# Altium schematic sheet Micro-Controller Unit (MCU).SchDoc
size B; SheetNumber: 5; SheetTotal: 5
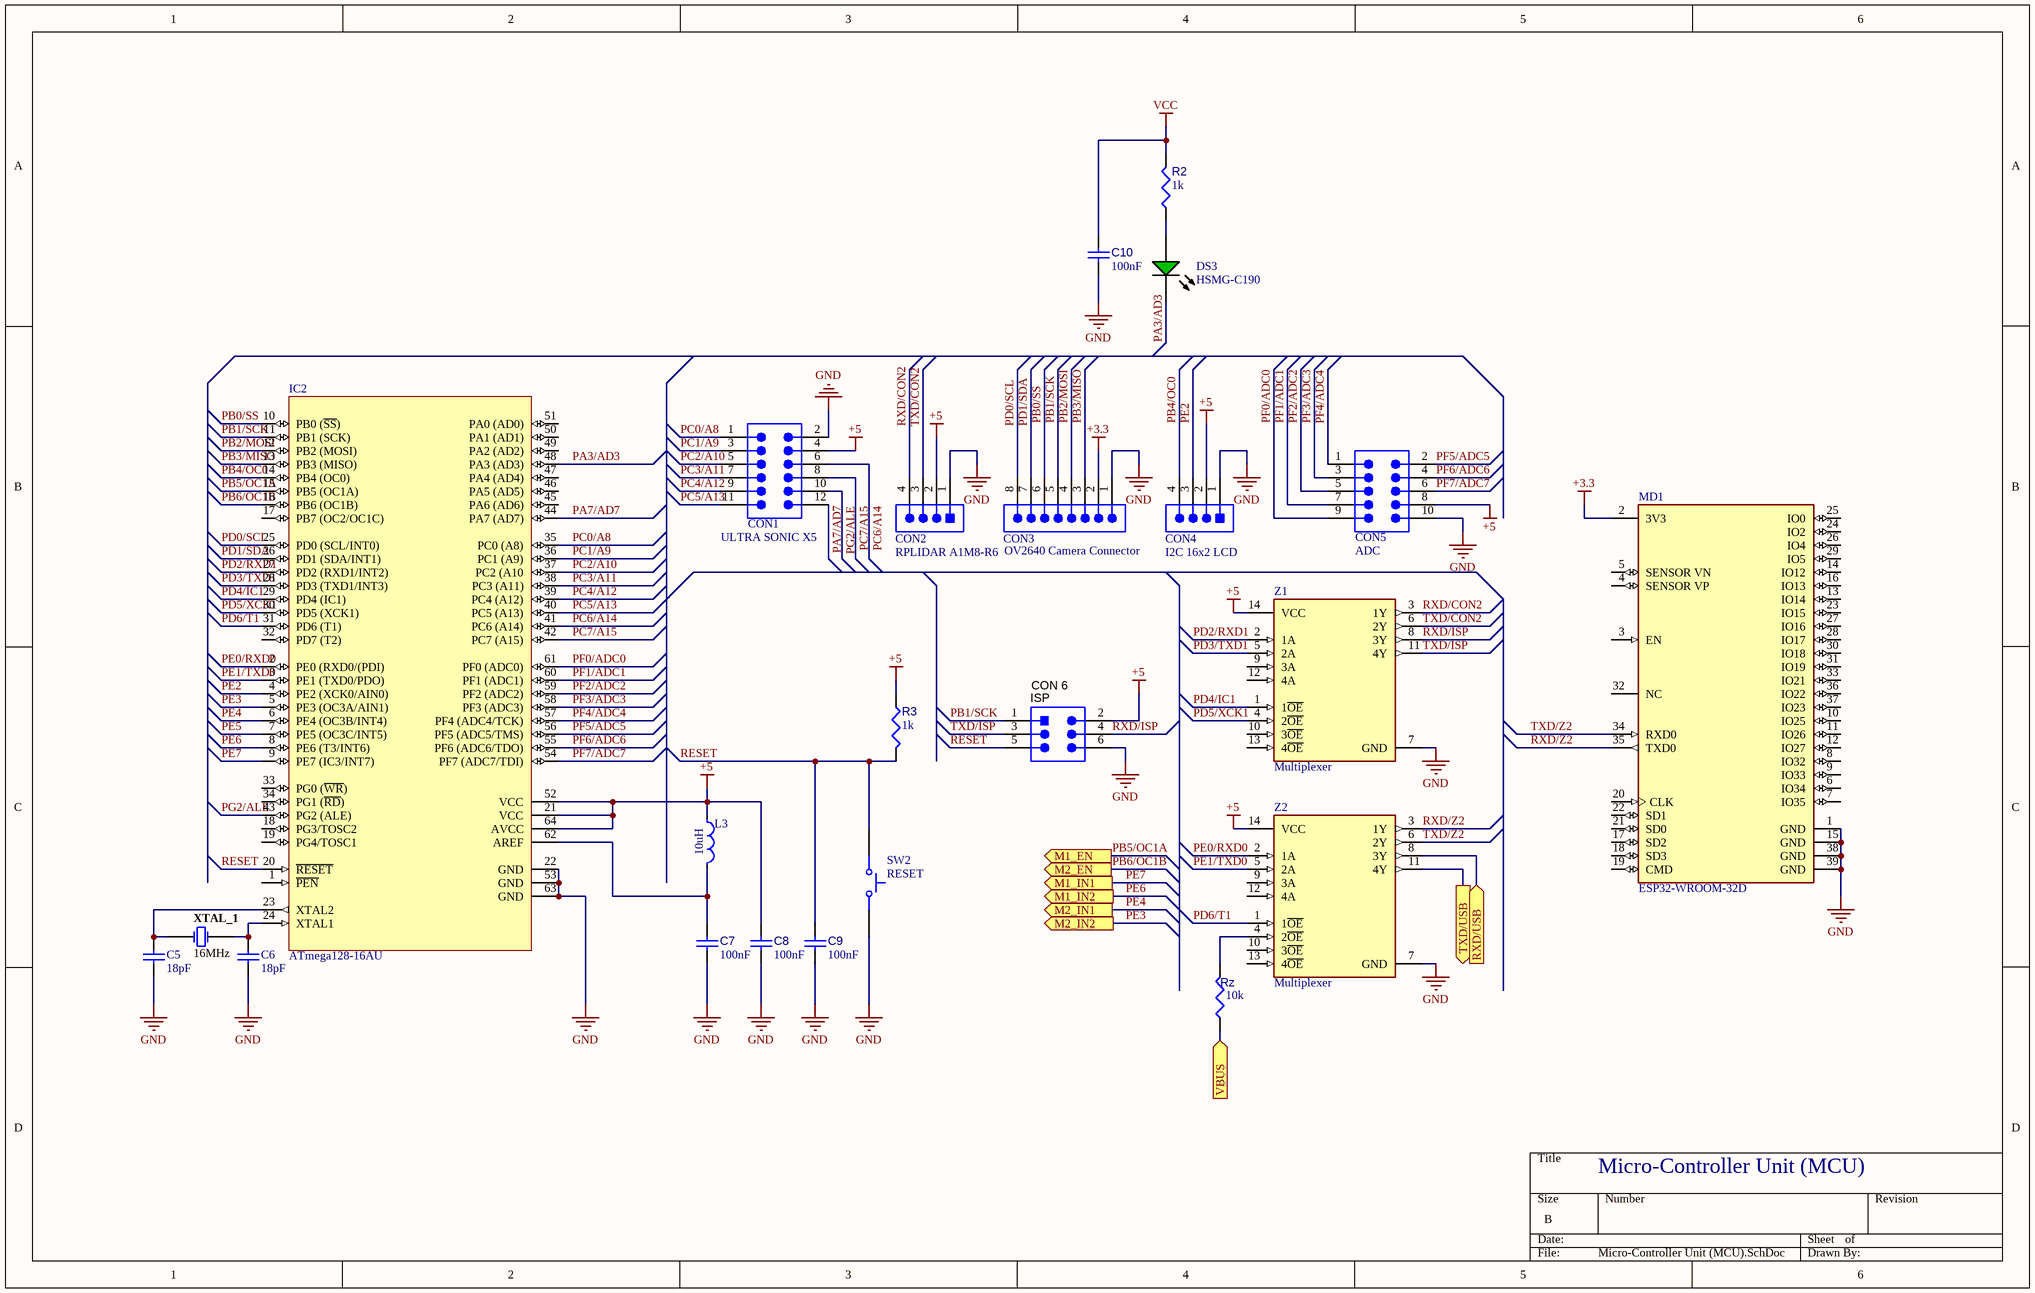
[diagram p0: Micro-Controller Unit (MCU).SchDoc]

## Parts
C5  18pF  [CAPC1608X90X40LL10T20]
C6  18pF  [CAPC1608X90X40LL10T20]
C7  value 100nF  [CAPC0402(1005)60_L]  (hidden comment: Capacitor 100nF +/-20% 50V 0402)
C8  value 100nF  [CAPC0402(1005)60_L]  (hidden comment: Capacitor 100nF +/-20% 50V 0402)
C9  value 100nF  [CAPC0402(1005)60_L]  (hidden comment: Capacitor 100nF +/-20% 50V 0402)
C10  value 100nF  [CAPC0402(1005)60_L]  (hidden comment: Capacitor 100nF +/-20% 50V 0402)
CON1  ULTRA SONIC X5  [61301221121]
CON2  RPLIDAR A1M8-R6  [MOLX-22-27-2041_V]
CON3  OV2640 Camera Connector  [61300811121]
CON4  I2C 16x2 LCD  [MOLX-22-27-2041_V]
CON5  ADC  [SMTC-TSM-105-01-X-DV]
DS3  HSMG-C190  [AVAG-HSMX-C190_V]
IC2  ATmega128-16AU  [64A_M]
ISP  CON 6  [AMPM-95278-101A06LF_V]
L3  10uH  [FP-IHLP-2525EZ-FP_2_413x3-MFG]
MD1  ESP32-WROOM-32D  [FP-ESP32-WROOM-32D-MFG]
R2  value 1k  [RESC1608X55X25ML10T15]  (hidden comment: Resistor 1k +/-1% 0603 100 mW)
R3  value 1k  [RESC1608X55X25ML10T15]  (hidden comment: Resistor 1k +/-1% 0603 100 mW)
Rz  value 10k  [RESC0402(1005)_L]  (hidden comment: 10KR2F)
SW2  RESET  [OMRON-B3U-1000_V]
XTAL_1  16MHz  [JPY-HC-49US]
Z1  Multiplexer  [FP-PW0014A-IPC_B]
Z2  Multiplexer  [FP-PW0014A-IPC_B]

## Ports
M1_EN (out), M1_IN1 (out), M1_IN2 (out), M2_EN (out), M2_IN1 (out), M2_IN2 (out), RXD/USB (in), TXD/USB (out), VBUS (in)

## Nets
+3.3: CON3.2 MD1.2(3V3)
+5: C8.1 CON1.4 CON2.2 CON4.2 CON5.8 IC2.21(VCC) IC2.52(VCC) IC2.64(AVCC) ISP.2 L3.1 R3.1 Z1.14(VCC) Z2.14(VCC)
GND: C5.1 C6.1 C7.2 C8.2 C9.2 C10.2 CON1.2 CON2.1 CON3.1 CON4.1 CON5.10 IC2.22(GND) IC2.53(GND) IC2.63(GND) ISP.6 MD1.1(GND) MD1.15(GND) MD1.38(GND) MD1.39(GND) SW2.2 Z1.7(GND) Z2.7(GND)
VCC: C10.1 R2.2
PA3/AD3: DS3.2(K) IC2.48(PA3_(AD3))
PA7/AD7: CON1.12 IC2.44(PA7_(AD7))
PB0/SS: CON3.6 IC2.10(PB0_(~{SS}))
PB1/SCK: CON3.5 IC2.11(PB1_(SCK)) ISP.1
PB2/MOSI: CON3.4 IC2.12(PB2_(MOSI))
PB3/MISO: CON3.3 IC2.13(PB3_(MISO))
PB4/OC0: CON4.4 IC2.14(PB4_(OC0))
PB5/OC1A: IC2.15(PB5_(OC1A)) ; port M1_EN
PB6/OC1B: IC2.16(PB6_(OC1B)) ; port M2_EN
PC0/A8: CON1.1 IC2.35(PC0_(A8))
PC1/A9: CON1.3 IC2.36(PC1_(A9))
PC2/A10: CON1.5 IC2.37(PC2_(A10)
PC3/A11: CON1.7 IC2.38(PC3_(A11))
PC4/A12: CON1.9 IC2.39(PC4_(A12))
PC5/A13: CON1.11 IC2.40(PC5_(A13))
PC6/A14: CON1.6 IC2.41(PC6_(A14))
PC7/A15: CON1.8 IC2.42(PC7_(A15))
PD0/SCL: CON3.8 IC2.25(PD0_(SCL/INT0))
PD1/SDA: CON3.7 IC2.26(PD1_(SDA/INT1))
PD2/RXD1: IC2.27(PD2_(RXD1/INT2)) Z1.2(1A)
PD3/TXD1: IC2.28(PD3_(TXD1/INT3)) Z1.5(2A)
PD4/IC1: IC2.29(PD4_(IC1)) Z1.1(1~{OE})
PD5/XCK1: IC2.30(PD5_(XCK1)) Z1.4(2~{OE})
PD6/T1: IC2.31(PD6_(T1)) Z2.1(1~{OE})
PE0/RXD0: IC2.2(PE0_(RXD0/(PDI)) Z2.2(1A)
PE1/TXD0: IC2.3(PE1_(TXD0/PDO)) Z2.5(2A)
PE2: CON4.3 IC2.4(PE2_(XCK0/AIN0))
PE3: IC2.5(PE3_(OC3A/AIN1)) ; port M2_IN2
PE4: IC2.6(PE4_(OC3B/INT4)) ; port M2_IN1
PE5: IC2.7(PE5_(OC3C/INT5))
PE6: IC2.8(PE6_(T3/INT6)) ; port M1_IN2
PE7: IC2.9(PE7_(IC3/INT7)) ; port M1_IN1
PF0/ADC0: CON5.9 IC2.61(PF0_(ADC0))
PF1/ADC1: CON5.7 IC2.60(PF1_(ADC1))
PF2/ADC2: CON5.5 IC2.59(PF2_(ADC2))
PF3/ADC3: CON5.3 IC2.58(PF3_(ADC3))
PF4/ADC4: CON5.1 IC2.57(PF4_(ADC4/TCK))
PF5/ADC5: CON5.2 IC2.56(PF5_(ADC5/TMS))
PF6/ADC6: CON5.4 IC2.55(PF6_(ADC6/TDO))
PF7/ADC7: CON5.6 IC2.54(PF7_(ADC7/TDI))
PG2/ALE: CON1.10 IC2.43(PG2_(ALE))
RESET: C9.1 IC2.20(~{RESET}) ISP.5 R3.2 SW2.1
RXD/CON2: CON2.4 Z1.3(1Y)
RXD/ISP: ISP.4 Z1.8(3Y)
RXD/USB: Z2.8(3Y) ; port RXD/USB
RXD/Z2: MD1.35(TXD0) Z2.3(1Y)
TXD/CON2: CON2.3 Z1.6(2Y)
TXD/ISP: ISP.3 Z1.11(4Y)
TXD/USB: Z2.11(4Y) ; port TXD/USB
TXD/Z2: MD1.34(RXD0) Z2.6(2Y)
VBUS: Rz.1 ; port VBUS
NetC5_2: C5.2 IC2.23(XTAL2) XTAL_1.1
NetC6_2: C6.2 IC2.24(XTAL1) XTAL_1.2
NetC7_1: C7.1 IC2.62(AREF) L3.2
NetDS3_1: DS3.1(A) R2.1
NetRz_2: Rz.2 Z2.4(2~{OE})

Not connected (* = marked no-connect by the designer): IC2 1(~{PEN}) 17(PB7_(OC2/OC1C)) 18(PG3/TOSC2) 19(PG4/TOSC1) 32(PD7_(T2)) 33(PG0_(~{WR})) 34(PG1_(~{RD})) 45(PA6_(AD6)) 46(PA5_(AD5)) 47(PA4_(AD4)) 49(PA2_(AD2)) 50(PA1_(AD1)) 51(PA0_(AD0)); MD1 3(EN) 4(SENSOR_VP) 5(SENSOR_VN) 6(IO34) 7(IO35) 8(IO32) 9(IO33) 10(IO25) 11(IO26) 12(IO27) 13(IO14) 14(IO12) 16(IO13) 17(SD2) 18(SD3) 19(CMD) 20(CLK) 21(SD0) 22(SD1) 23(IO15) 24(IO2) 25(IO0) 26(IO4) 27(IO16) 28(IO17) 29(IO5) 30(IO18) 31(IO19) 32(NC) 33(IO21) 36(IO22) 37(IO23); Z1 9(3A) 10(3~{OE}) 12(4A) 13(4~{OE}); Z2 9(3A) 10(3~{OE}) 12(4A) 13(4~{OE})

## Notes on the sheet
- Micro-Controller Unit (MCU)

## Library data of the parts
C5 C6 = CMP-1659-00030-1: Chip Capacitor, 18 pF, +/- 5%, 50 V, -55 to 125 degC, 0603 (1608 Metric), RoHS, Tape and Reel; Voltage Rating: 50 V; Case\Package: 0603; Power Rating: 100 mW; Resistance: 68.1 Ohm; Tolerance: 1%; Case Code (Metric): 1608; Max Operating Temperature: 155 degC; RoHSCompliant: true; Case Code (Imperial): 0603; ComponentLink2Description: Datasheet; Package Quantity: 200; PackageReference: 0603; ComponentLink2URL: http://www.yageo.com/NewPortal/yageodocoutput?fileName=/pdf/MLCC/UPY-GP_NP0_16V-to-50V_14.pdf; Length: 1.6 mm; DatasheetVersion: Rev. 14, 07/2016; Min Operating Temperature: -55 degC; ComponentLink1URL: http://www.yageo.com/; Width: 0.8 mm; ComponentLink1Description: Manufacturer URL; Height: 0.45 mm; Radiation Hardening: No; PackageDescription: 2-Pin Surface Mount Device, Body 1.6 x 0.8 mm; Packaging: Tape and Reel
C7-C10 = CMP-001-00067-3: Chip Capacitor, 100nF +/-20%, 50V, 0402, Thickness 0.6 mm; Tolerance: 10%; Min Operating Temperature: -55°C; Pins: 2; Case/Package: 0402; Max Operating Temperature: 85°C; Voltage Rating: 50V; Mounting Technology: SMT
CON1 = CMP-1502-01088-4: NexarPartId: 32855540; Gender: Male; Row Spacing: 2.54mm; Number of Contacts: 12; Contact Resistance: 20mΩ; Connector Type: Male Pin; Current Rating: 3A; Operating Supply Voltage: 250V; Termination: Solder; Contact Plating: Gold; Height: 8.89mm; Color: Black; Contact Mating Length: 5.9944mm; REACH SVHC: Unknown; Mount: Through Hole; Orientation: Vertical; Number of Rows: 2; Packaging: Bulk; Number of Pins: 12; Number of Positions: 12; Contact Material: Copper; Lead Pitch: 2.54mm; Min Operating Temperature: -40°C; Voltage Rating: 250V; RoHS: Compliant; Pitch: 2.54mm; Max Operating Temperature: 105°C
CON2 CON4 = CMP-2000-05243-1: Male Header, Pitch 2.54 mm, 1 x 4 Position, Height 11.7 mm, Tail Length 3.56 mm, RoHS, Bulk; Manufacturer: Molex; Voltage rating: 250V; Current rating: 4A; Datasheet Version: Rev. F, 06/2009; Operating temperature: 0degCto+75degC; Contact material: Tinplatedbrass; Manufacturer URL: http://www.molex.com/; Housing material: Nylon(UL94V-0); Datasheet URL: http://www.molex.com/pdm_docs/sd/022272041_sd.pdf
CON3 = CMP-1502-01076-3: NexarPartId: 32855533; Connector Type: Male Pin; Number of Contacts: 8; Voltage Rating: 250V; Current Rating: 3A; Contact Resistance: 20mΩ; Pitch: 2.54mm; Gender: Male; Termination: Solder; Contact Material: Copper; Mount: Through Hole; Lead Pitch: 2.54mm; Number of Positions: 8; Operating Supply Voltage: 250V; Number of Pins: 8; Max Operating Temperature: 105°C; Height: 8.54mm; REACH SVHC: Unknown; Number of Rows: 1; Packaging: Bulk; Contact Plating: Gold; Contact Mating Length: 5.9944mm; Orientation: Vertical; RoHS: Compliant; Color: Black; Min Operating Temperature: -40°C
CON5 = CMP-1024-00233-1: 0.025" SQ Post Header, Surface Mount, Vertical, -55 to 125 degC, 2.54 mm Pitch, 10-Pin, Male, RoHS; PartNumber: TSM-105-01-L-DV; Manufacturer: Samtec; Pitch: 2.54 mm; ComponentLink1URL: http://www.samtec.com; DatasheetVersion: F-214; ComponentLink3URL: http://www.samtec.com/documents/webfiles/cpdf/TSM-1XX-XX-XXX-XX-X-XXX-X-MKT.pdf; Temperature Range: -55 to 125 degC; PackageDescription: Double Row Gullwing ASM; ComponentLink2URL: http://www.samtec.com/documents/webfiles/pdf/TSM.PDF; ComponentLink2Description: Datasheet; Mounting Technology: Surface Mount; PackageVersion: DJ, 4/1991; RoHS: True; ComponentLink3Description: Package Specification; PackageReference: TSM-105-01-X-DV; Orientation: Vertical; ComponentLink1Description: Manufacturer URL
DS3 = CMP-007-00013-2: LED Uni-Color Green, 52 mW, 20 mA, -40 to 85 degC, 2-Pin SMD, RoHS, Tape and Reel; Manufacturer: Avago; Forward Current: 20mA; Viewing Angle: 170degrees; Luminous Intensity: 15mcd; Lens Style: Diffused; Forward Voltage: 2.2V; Power: 52mW; Mounting Technology: SM; RoHS Compliant: True; Packaging: TapeandReel; Illumination Colour: Green; Datasheet URL: http://docs.avagotech.com/docs/AV02-0551EN; Min Operating Temperature: -40°C; Max Operating Temperature: 85°C; Pins: 2; Package Description: 2-Pin Surface Mount Device, Body 1.6 x 0.8 mm, Height 0.9 mm; Nominal Vf: 2.2V; Case/Package: 0603; Manufacturer URL: http://www.avagotech.com/; Datasheet Version: Mar-12; Colour: Green; Package Reference: HSMX-C190; Package Quantity: 4000
IC2 = CMP-0095-00259-2: 8-bit AVR Microcontroller, 4.5-5.5V, 128KB Flash, 4KB EEPROM, 4KB SRAM, 64-pin TQFP, Industrial Grade (-40°C to 85°C); ComponentLink3URL: http://www.atmel.com/dyn/resources/prod_documents/2467S.pdf; PackageVersion: revC, Oct-2010; ComponentLink2URL: http://www.atmel.com/dyn/resources/prod_documents/doc2467.pdf; ComponentLink2Description: ATmega128(L) Datasheet; ComponentLink1Description: Manufacturer URL; PackageReference: 64A; DatasheetVersion: revX, Jun-2011; ComponentLink3Description: ATmega128(L) Summary; ComponentLink1URL: http://www.atmel.com/; RevisionNote: PackageVersion updated. URLs added.; Code_JEDEC: MS-026-AEB; PackageDescription: 64-Pin Plastic Thin Profile Quad Flat Pack, 14 x 14 x 1.0 mm Body, 0.8 mm Pitch (TQFP)
ISP = CMP-002-00024-2: Male Header, Pitch 2.54 mm, 2 x 3 Position, Height 14.4 mm, RoHS, Tape and Reel; Manufacturer: Amphenol; Package Reference: 95278-101A06LF; Package Description: Male Header, Pitch 2.54 mm, 2 x 3 Position, Height 14.4 mm; RoHS Compliant: Unknown; Case/Package: 95278-101A06LF; Connector Type: Header; Mounting Technology: SM; Gender: Male; Datasheet URL: http://portal.fciconnect.com/Comergent//fci/drawing/95278.pdf; Datasheet Version: Rev. AC, 03/2016
L3 = CMP-02424-000296-1: Commercial Inductors, High Saturation Series 10uH 4.5A 71.3mΩ 20%; Shielding: Shielded; Test Frequency: 100kHz; DC Resistance (DCR): 71.3mR; Self Resonant Frequency: 1MHz; Core Material: Ferrite; Length: 7.24mm; Height - Seated (Max): 0.197inch; Inductance Tolerance: 20%; Case Code (Metric): 6363; Radiation Hardening: No; Min Operating Temperature: -55°C; Package Quantity: 500; Contact Plating: Tin; Number of Pins: 2; Max DC Current: 4.5A; Packaging: Tape and Reel; Military Standard: Not; Saturation Current: 4.5A; Width: 0.255inch; Tolerance: 20%; Mount: Surface Mount; Termination: SMD/SMT; Max Operating Temperature: 125°C; Case/Package: 2525; Lead Free: Lead Free; Depth: 6.72mm; Current Rating: 4.5A; Height: 5mm; Case Code (Imperial): 2525; Inductance: 10uH; RMS Current (Irms): 4.5A
MD1 = CMP-194065-000003-1: WIFI MODULE 32MBITS SPI FLASH; Manufacturer: Espressif Systems; Max Supply Voltage: 3.6V; Nominal Supply Current: 500mA; Max Frequency: 2484MHz; Number Of Adc Channels: 16; Number Of Gpio: 32; Interface: I2C,SPI,UART,Ethernet,I2S,Other; Data Rate: 150Mbits/s; Min Supply Voltage: 3V; Bandwidth: 72MHz; Sensitivity: -98dBm; Octopart: https://octopart.com/esp32-wroom-32d-espressif+systems-91040050; Package: ESP32-WROOM-32D; ComponentLink2URL: https://www.espressif.com/sites/default/files/documentation/esp32-wroom-32d_esp32-wroom-32u_datasheet_en.pdf; Lead Free: Yes; Category: UNK; Mouser Description: Wi-Fi/BT BLE Module ESP32-D0WD, SPI Flash, UART, P; Device Class L1: Integrated Circuits (ICs); RoHS: TRUE; Temperature Range Low: -40°C; ComponentLink2Description: Datasheet; Digikey Description: WIFI MODULE 32MBITS SPI FLASH; Height: 3.2mm; Temperature: -40°C to +85°C; Manufacturer Part Number: ESP32-WROOM-32D; Device Class L3: Transceivers; Device Class L2: RF Semiconductors and Devices; Temperature Range High: +85°C; Automotive: No
R2 R3 = CMP-009-00014-5: Chip Resistor, 1 KOhm, +/-1%, 0.1 W, -55 to 155 degC, 0603 (1608 Metric); Voltage Rating: 50V; Power: 100mW; Tolerance: 1%; Mounting Technology: SM; Pins: 2; Case/Package: 0603; Min Operating Temperature: -55°C; RoHS Compliant: True; Max Operating Temperature: 155°C
Rz = CMP-009-00066-2: 10K 0.063W 1% 0402 (1005 Metric)  SMD; Power: 63mW; Case/Package: 0402; Mounting Technology: SMT; Pins: 2; Tolerance: 1%
SW2 = CMP-011-00000-2: Tactile Switch, SPST-NO, 0.05 A, 12 V, -25 to 70 degC, 2-Pin SMD, RoHS, Tape and Reel; Manufacturer: Omron Electronic Components; IP Rating: IP40; Current Rating: 50mA; Max Contact Resistance: 100mohm; Operating Force: 153gf; Throw Configuration: SPST; Resistance: 0.1Ohm; Max Voltage Rating (DC): 12V; Contact Material: Silver; Max Current Rating: 50mA; Datasheet URL: http://www.omron.com/ecb/products/pdf/en-b3u.pdf; Mounting Technology: SM; Case/Package: B3U-1000; Packaging: TapeandReel; Package Reference: B3U-1000; Manufacturer URL: http://www.omron.com/; Datasheet Version: Jan-15; RoHS Compliant: True; Max Operating Temperature: 70°C; Contact Current Rating: 50mA; Package Quantity: 3500; Package Description: 2-Pin Surface Mount Device, Body 3 x 2.5 mm; Voltage Rating (DC): 12V; Min Operating Temperature: -25°C; Voltage Rating: 12V
XTAL_1 = CMP-003-00005-2: Crystal, 16 MHz, +/- 30 ppm, 18 pF, -20 to 70 degC, 2-Pin THD; Manufacturer: Jing peng yuan; Frequency: 16MHz; Package Reference: HC-49US; Case/Package: HC-49US; RoHS Compliant: Unknown; Mounting Technology: TH; Package Description: 2-Pin Throug Hole Device, Body 11.05 x 4.65 mm, Pitch 4.9 mm; Datasheet URL: https://statics3.seeedstudio.com/images/opl/datasheet/306010014.pdf; Datasheet Version: May-15
Z1 Z2 = CMP-0440-00179-4: IC BUF NON-INVERT 3.6V 14TSSOP; Max Power Dissipation: 500mW; Number of Bits per Element: 1; Number of Bits: 4; Quiescent Current: 1uA; Min Supply Voltage: 1.65V; Propagation Delay: 4.6ns; High Level Output Current: -24mA; Logic Function: Buffer; Low Level Output Current: 24mA; Polarity: Non-Inverting; Turn-On Delay Time: 5.3ns; Number of Output Lines: 3; Mount: Surface Mount; Lead Free: Lead Free; Number of Outputs: 4; Max Supply Voltage: 3.6V; Packaging: Tape and Reel; Radiation Hardening: No; Number of Channels: 4; REACH SVHC: No SVHC; Length: 5mm; Number of Elements: 4; Contact Plating: Gold; Case/Package: TSSOP; Number of Input Lines: 4; Number of Inputs: 4; Height: 1.15mm; Number of Circuits: 4; Termination: SMD/SMT; Min Operating Temperature: -40°C; Package Quantity: 1; Number of Gates: 4; Max Operating Temperature: 125°C; Width: 4.4mm; Number of Pins: 14